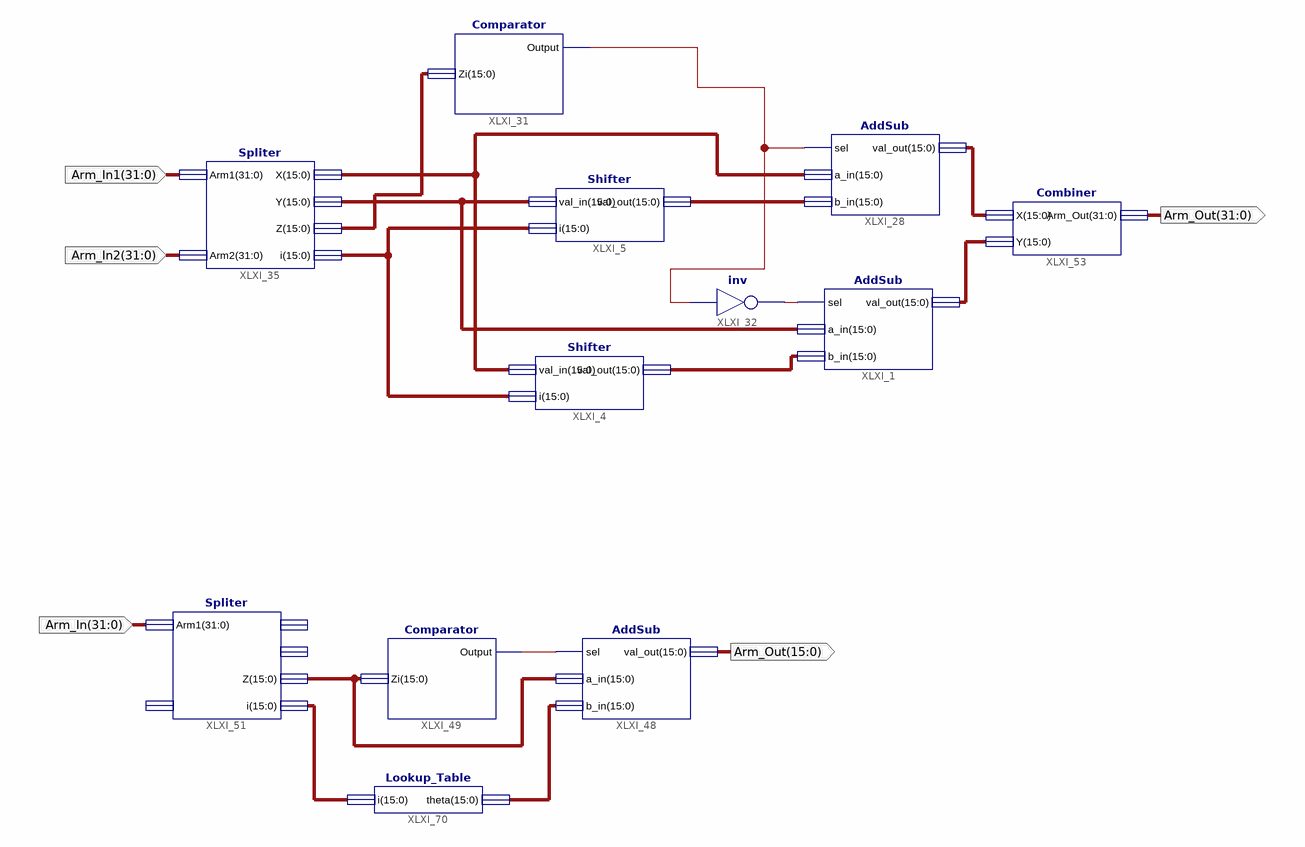
[diagram p0: schematic sheet 1]
// Xilinx ISE schematic ALU.sch (spartan3e) as structural Verilog: 12 symbols, 5 ports
module ALU (
  input  [31:0] Arm_In1,
  input  [31:0] Arm_In2,
  input  [31:0] Arm_In,
  output [31:0] Arm_Out
);

  wire XLXN_69, XLXN_70, XLXN_158;
  wire [15:0] XLXN_64, XLXN_66, XLXN_107, XLXN_108, XLXN_157, XLXN_159, XLXN_160;
  wire [31:0] X, XLXN_36, XLXN_41, Y;

  Shifter XLXI_5 (.val_in(Y), .i(XLXN_64), .val_out(XLXN_36));
  AddSub XLXI_28 (.sel(XLXN_69), .a_in(X), .b_in(XLXN_36), .val_out(XLXN_107));
  AddSub XLXI_1 (.sel(XLXN_70), .a_in(Y), .b_in(XLXN_41), .val_out(XLXN_108));
  Shifter XLXI_4 (.val_in(X), .i(XLXN_64), .val_out(XLXN_41));
  Comparator XLXI_31 (.Zi(XLXN_66), .Output(XLXN_69));
  not XLXI_32 (XLXN_70, XLXN_69);
  Spliter XLXI_35 (.Arm1(Arm_In1), .Arm2(Arm_In2), .X(X), .Y(Y), .Z(XLXN_66), .i(XLXN_64));
  Combiner XLXI_53 (.X(XLXN_107), .Y(XLXN_108), .Arm_Out(Arm_Out));
  Spliter XLXI_51 (.Arm1(Arm_In), .Z(XLXN_157), .i(XLXN_159));  // open: Arm2, X, Y
  Comparator XLXI_49 (.Zi(XLXN_157), .Output(XLXN_158));
  AddSub XLXI_48 (.sel(XLXN_158), .a_in(XLXN_157), .b_in(XLXN_160), .val_out(Arm_Out[15:0]));
  Lookup_Table XLXI_70 (.i(XLXN_159), .theta(XLXN_160));
endmodule
